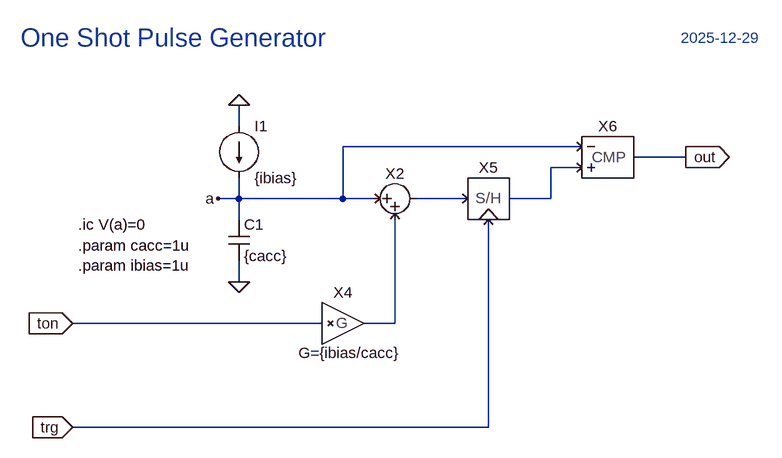
[diagram p0: schematic ONESHOT.asc]
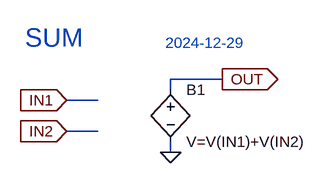
[diagram p1: sub-circuit sum.asc]
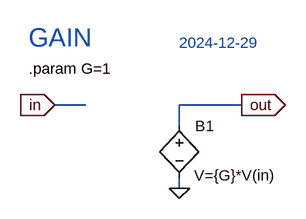
[diagram p2: sub-circuit gain.asc]
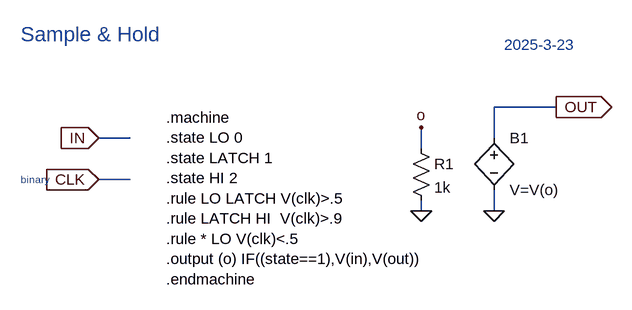
[diagram p3: sub-circuit samplehold.asc]
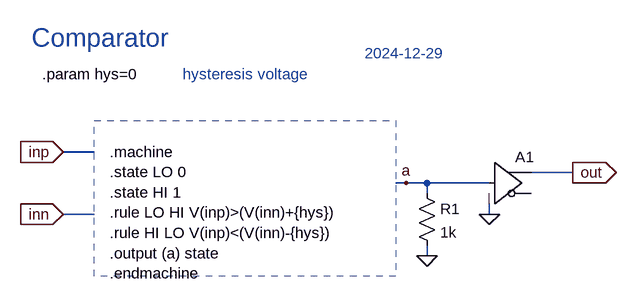
[diagram p4: sub-circuit cmp.asc]
ONESHOT.asc, the LTspice schematic file:
Version 4.1
SHEET 1 1156 848
WIRE 336 224 336 192
WIRE 864 256 496 256
WIRE 1024 272 944 272
WIRE 864 288 816 288
WIRE 336 336 336 304
WIRE 336 336 304 336
WIRE 496 336 496 256
WIRE 496 336 336 336
WIRE 544 336 496 336
WIRE 688 336 608 336
WIRE 816 336 816 288
WIRE 816 336 752 336
WIRE 336 368 336 336
WIRE 336 464 336 432
WIRE 464 528 80 528
WIRE 576 528 576 368
WIRE 576 528 528 528
WIRE 720 688 720 368
WIRE 720 688 80 688
FLAG 336 192 0
FLAG 336 464 0
FLAG 1024 272 out
IOPIN 1024 272 Out
FLAG 304 336 a
FLAG 80 528 ton
IOPIN 80 528 In
FLAG 80 688 trg
IOPIN 80 688 In
SYMBOL current 336 224 R0
SYMATTR InstName I1
SYMATTR Value {ibias}
SYMBOL cap 320 368 R0
SYMATTR InstName C1
SYMATTR Value {cacc}
SYMBOL PowerSim\\SUM 576 336 R0
SYMATTR InstName X2
SYMBOL PowerSim\\GAIN 496 528 R0
WINDOW 39 9 61 Bottom 2
SYMATTR SpiceLine G={ibias/cacc}
SYMATTR InstName X4
SYMBOL PowerSim\\SAMPLEHOLD 720 336 R0
SYMATTR InstName X5
SYMBOL PowerSim\\CMP 912 272 R0
SYMATTR InstName X6
TEXT 0 88 Left 4 ;One Shot Pulse Generator
TEXT 88 408 Left 2 !.param cacc=1u\n.param ibias=1u
TEXT 88 376 Left 2 !.ic V(a)=0
TEXT 1016 88 Left 2 ;2025-12-29

sum.asc, the sub-circuit schematic file:
Version 4
SHEET 1 880 680
WIRE 288 96 208 96
WIRE 208 112 208 96
WIRE 96 128 48 128
WIRE 96 176 48 176
WIRE 208 208 208 192
FLAG 48 128 IN1
IOPIN 48 128 In
FLAG 48 176 IN2
IOPIN 48 176 In
FLAG 208 208 0
FLAG 288 96 OUT
IOPIN 288 96 Out
SYMBOL bv 208 96 R0
SYMATTR InstName B1
SYMATTR Value V=V(IN1)+V(IN2)
TEXT -16 32 Left 4 ;SUM
TEXT 200 40 Left 2 ;2024-12-29

gain.asc, the sub-circuit schematic file:
Version 4
SHEET 1 880 680
WIRE 0 64 -48 64
WIRE 240 64 144 64
WIRE 144 96 144 64
WIRE 144 192 144 176
FLAG 144 192 0
FLAG 240 64 out
IOPIN 240 64 Out
FLAG -48 64 in
IOPIN -48 64 In
SYMBOL bv 144 80 R0
WINDOW 3 23 92 Left 2
SYMATTR Value V={G}*V(in)
SYMATTR InstName B1
TEXT -88 8 Left 2 !.param G=1
TEXT -88 -40 Left 4 ;GAIN
TEXT 144 -32 Left 2 ;2024-12-29

samplehold.asc, the sub-circuit schematic file:
Version 4
SHEET 1 880 680
WIRE 576 -560 480 -560
WIRE -80 -512 -128 -512
WIRE 480 -512 480 -560
WIRE 368 -496 368 -528
WIRE -80 -448 -128 -448
WIRE 368 -400 368 -416
WIRE 480 -400 480 -432
FLAG -128 -512 IN
IOPIN -128 -512 In
FLAG -128 -448 CLK
IOPIN -128 -448 In
FLAG 576 -560 OUT
IOPIN 576 -560 Out
FLAG 368 -400 0
FLAG 368 -528 o
FLAG 480 -400 0
SYMBOL res 352 -512 R0
SYMATTR InstName R1
SYMATTR Value 1k
SYMBOL bv 480 -528 R0
SYMATTR InstName B1
SYMATTR Value V=V(o)
TEXT -248 -672 Left 3 ;Sample & Hold
TEXT -248 -448 Left 1 ;binary
TEXT 496 -656 Left 2 ;2025-3-23
TEXT -24 -544 Left 2 !.machine\n.state LO 0\n.state LATCH 1\n.state HI 2\n.rule LO LATCH V(clk)>.5\n.rule LATCH HI  V(clk)>.9\n.rule * LO V(clk)<.5\n.output (o) IF((state==1),V(in),V(out))  \n.endmachine

cmp.asc, the sub-circuit schematic file:
Version 4
SHEET 1 1276 680
WIRE 352 96 304 96
WIRE 1088 128 1024 128
WIRE 832 144 816 144
WIRE 864 144 832 144
WIRE 960 144 864 144
WIRE 864 160 864 144
WIRE 352 192 304 192
WIRE 960 192 960 176
WIRE 864 256 864 240
FLAG 304 96 inp
IOPIN 304 96 In
FLAG 304 192 inn
IOPIN 304 192 In
FLAG 1088 128 out
IOPIN 1088 128 Out
FLAG 864 256 0
FLAG 832 144 a
FLAG 960 192 0
SYMBOL res 848 144 R0
SYMATTR InstName R1
SYMATTR Value 1k
SYMBOL Digital\\buf 960 80 R0
SYMATTR InstName A1
TEXT 376 96 Left 2 !.machine\n.state LO 0\n.state HI 1\n.rule LO HI V(inp)>(V(inn)+{hys})\n.rule HI LO V(inp)<(V(inn)-{hys})\n.output (a) state\n.endmachine
TEXT 272 -24 Left 2 !.param hys=0
TEXT 256 -80 Left 4 ;Comparator
TEXT 488 -24 Left 2 ;hysteresis voltage
TEXT 768 -56 Left 2 ;2024-12-29
RECTANGLE Normal 816 288 352 48 2

The netlist it stands for:
* ONESHOT.asc
I1 0 a {ibias}
C1 a 0 {cacc}
X§X2 a N003 N002 sum
X§X4 ton N003 gain params: G={ibias/cacc}
X§X5 trg N002 N001 samplehold
X§X6 a N001 out cmp params: hys=0

* block symbol definitions
.subckt sum in1 in2 out
B1 OUT 0 V=V(IN1)+V(IN2)
* SUM
* 2024-12-29
.ends sum

.subckt gain in out
B1 out 0 V={G}*V(in)
.param G=1
* GAIN
* 2024-12-29
.ends gain

.subckt samplehold CLK IN OUT
R1 o 0 1k
B1 OUT 0 V=V(o)
* Sample & Hold
* binary
* 2025-3-23
.machine
.state LO 0
.state LATCH 1
.state HI 2
.rule LO LATCH V(clk)>.5
.rule LATCH HI  V(clk)>.9
.rule * LO V(clk)<.5
.output (o) IF((state==1),V(in),V(out))
.endmachine
.ends samplehold

.subckt cmp inn inp out
R1 a 0 1k
A1 a 0 0 0 0 0 out 0 BUF
.machine
.state LO 0
.state HI 1
.rule LO HI V(inp)>(V(inn)+{hys})
.rule HI LO V(inp)<(V(inn)-{hys})
.output (a) state
.endmachine
.param hys=0
* Comparator
* hysteresis voltage
* 2024-12-29
.ends cmp

* One Shot Pulse Generator
.param cacc=1u
.param ibias=1u
.ic V(a)=0
* 2025-12-29
.backanno
.end